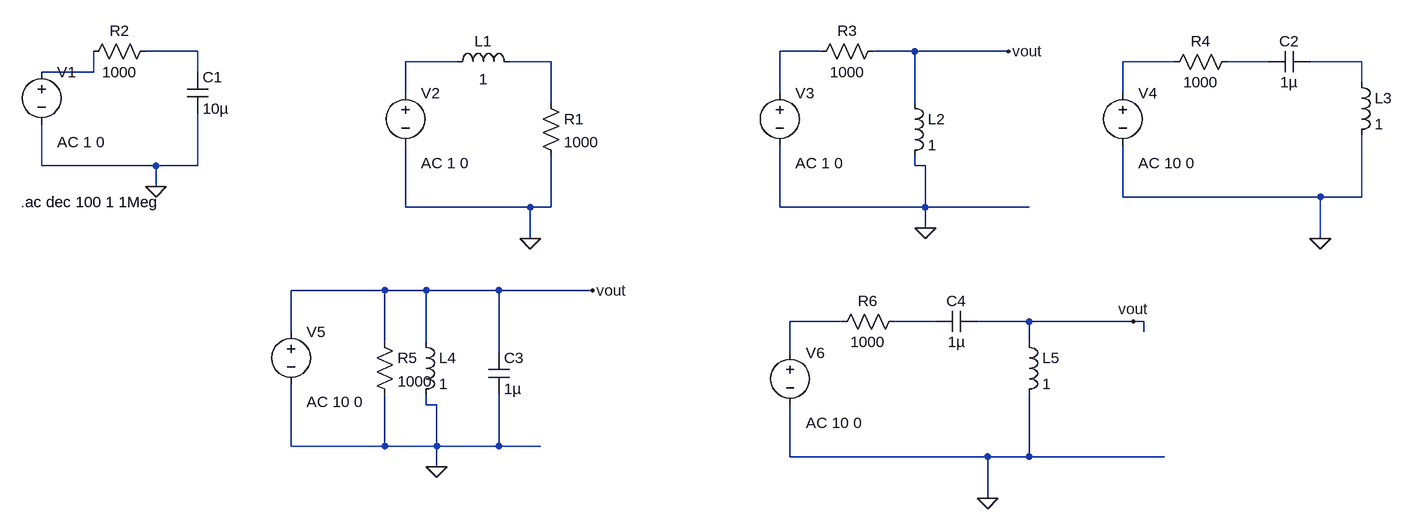
[diagram p0: schematic Draft1.asc]
Draft1.asc, the LTspice schematic file:
Version 4.1
SHEET 1 2116 884
WIRE 272 176 192 176
WIRE 1232 176 1168 176
WIRE 1376 176 1312 176
WIRE 1520 176 1376 176
WIRE 672 192 592 192
WIRE 816 192 752 192
WIRE 1776 192 1696 192
WIRE 1920 192 1856 192
WIRE 2064 192 1984 192
WIRE 112 208 112 176
WIRE 112 208 32 208
WIRE 272 208 272 176
WIRE 2064 224 2064 192
WIRE 592 240 592 192
WIRE 1168 240 1168 176
WIRE 1696 240 1696 192
WIRE 816 256 816 192
WIRE 1376 256 1376 176
WIRE 32 352 32 288
WIRE 208 352 32 352
WIRE 272 352 272 272
WIRE 272 352 208 352
WIRE 1376 352 1376 336
WIRE 1392 352 1376 352
WIRE 208 384 208 352
WIRE 1696 400 1696 320
WIRE 2000 400 1696 400
WIRE 2064 400 2064 304
WIRE 2064 400 2000 400
WIRE 592 416 592 320
WIRE 784 416 592 416
WIRE 816 416 816 336
WIRE 816 416 784 416
WIRE 1168 416 1168 320
WIRE 1392 416 1392 352
WIRE 1392 416 1168 416
WIRE 1552 416 1392 416
WIRE 1392 448 1392 416
WIRE 784 464 784 416
WIRE 2000 464 2000 400
WIRE 560 544 416 544
WIRE 624 544 560 544
WIRE 736 544 624 544
WIRE 880 544 736 544
WIRE 1264 592 1184 592
WIRE 1408 592 1344 592
WIRE 1552 592 1472 592
WIRE 1712 592 1552 592
WIRE 1728 592 1712 592
WIRE 416 608 416 544
WIRE 1728 608 1728 592
WIRE 560 624 560 544
WIRE 624 624 624 544
WIRE 1552 624 1552 592
WIRE 736 640 736 544
WIRE 1184 640 1184 592
WIRE 624 720 624 704
WIRE 640 720 624 720
WIRE 416 784 416 688
WIRE 560 784 560 704
WIRE 560 784 416 784
WIRE 640 784 640 720
WIRE 640 784 560 784
WIRE 736 784 736 704
WIRE 736 784 640 784
WIRE 800 784 736 784
WIRE 1184 800 1184 720
WIRE 1488 800 1184 800
WIRE 1552 800 1552 704
WIRE 1552 800 1488 800
WIRE 1760 800 1552 800
WIRE 640 816 640 784
WIRE 1488 864 1488 800
FLAG 208 384 0
FLAG 784 464 0
FLAG 1392 448 0
FLAG 2000 464 0
FLAG 640 816 0
FLAG 1488 864 0
FLAG 880 544 vout
FLAG 1520 176 vout
FLAG 1712 592 vout
DATAFLAG 736 608 ""
SYMBOL res 208 160 R90
WINDOW 0 0 56 VBottom 2
WINDOW 3 32 56 VTop 2
SYMATTR InstName R2
SYMATTR Value 1000
SYMBOL cap 256 208 R0
SYMATTR InstName C1
SYMATTR Value 10µ
SYMBOL voltage 32 192 R0
WINDOW 123 24 124 Left 2
WINDOW 39 0 0 Left 0
SYMATTR InstName V1
SYMATTR Value ""
SYMATTR Value2 AC 1 0
SYMBOL voltage 592 224 R0
WINDOW 123 24 124 Left 2
WINDOW 39 0 0 Left 0
SYMATTR InstName V2
SYMATTR Value ""
SYMATTR Value2 AC 1 0
SYMBOL res 800 240 R0
SYMATTR InstName R1
SYMATTR Value 1000
SYMBOL ind 656 208 R270
WINDOW 0 32 56 VTop 2
WINDOW 3 5 56 VBottom 2
SYMATTR InstName L1
SYMATTR Value 1
SYMBOL voltage 1168 224 R0
WINDOW 123 24 124 Left 2
WINDOW 39 0 0 Left 0
SYMATTR InstName V3
SYMATTR Value ""
SYMATTR Value2 AC 1 0
SYMBOL ind 1360 240 R0
SYMATTR InstName L2
SYMATTR Value 1
SYMBOL res 1328 160 R90
WINDOW 0 0 56 VBottom 2
WINDOW 3 32 56 VTop 2
SYMATTR InstName R3
SYMATTR Value 1000
SYMBOL voltage 1696 224 R0
WINDOW 123 24 124 Left 2
WINDOW 39 0 0 Left 0
SYMATTR InstName V4
SYMATTR Value ""
SYMATTR Value2 AC 10 0
SYMBOL res 1872 176 R90
WINDOW 0 0 56 VBottom 2
WINDOW 3 32 56 VTop 2
SYMATTR InstName R4
SYMATTR Value 1000
SYMBOL cap 1984 176 R90
WINDOW 0 0 32 VBottom 2
WINDOW 3 32 32 VTop 2
SYMATTR InstName C2
SYMATTR Value 1µ
SYMBOL ind 2048 208 R0
SYMATTR InstName L3
SYMATTR Value 1
SYMBOL voltage 416 592 R0
WINDOW 123 24 124 Left 2
WINDOW 39 0 0 Left 0
SYMATTR InstName V5
SYMATTR Value ""
SYMATTR Value2 AC 10 0
SYMBOL ind 608 608 R0
SYMATTR InstName L4
SYMATTR Value 1
SYMBOL res 544 608 R0
SYMATTR InstName R5
SYMATTR Value 1000
SYMBOL cap 720 640 R0
SYMATTR InstName C3
SYMATTR Value 1µ
SYMBOL voltage 1184 624 R0
WINDOW 123 24 124 Left 2
WINDOW 39 0 0 Left 0
SYMATTR InstName V6
SYMATTR Value ""
SYMATTR Value2 AC 10 0
SYMBOL res 1360 576 R90
WINDOW 0 0 56 VBottom 2
WINDOW 3 32 56 VTop 2
SYMATTR InstName R6
SYMATTR Value 1000
SYMBOL cap 1472 576 R90
WINDOW 0 0 32 VBottom 2
WINDOW 3 32 32 VTop 2
SYMATTR InstName C4
SYMATTR Value 1µ
SYMBOL ind 1536 608 R0
SYMATTR InstName L5
SYMATTR Value 1
TEXT 0 408 Left 2 !.ac dec 100 1 1Meg

The netlist it stands for:
* Draft1.asc
R2 N001 N008 1000
C1 N001 0 10µ
V1 N008 0 AC 1 0
V2 N003 0 AC 1 0
R1 N004 0 1000
L1 N003 N004 1
V3 N002 0 AC 1 0
L2 vout 0 1
R3 vout N002 1000
V4 N005 0 AC 10 0
R4 N006 N005 1000
C2 N007 N006 1µ
L3 N007 0 1
V5 vout 0 AC 10 0
L4 vout 0 1
R5 vout 0 1000
C3 vout 0 1µ
V6 N009 0 AC 10 0
R6 N010 N009 1000
C4 vout N010 1µ
L5 vout 0 1
.ac dec 100 1 1Meg
.backanno
.end